# EAGLE schematic max7219-martix (EAGLE 6.4)
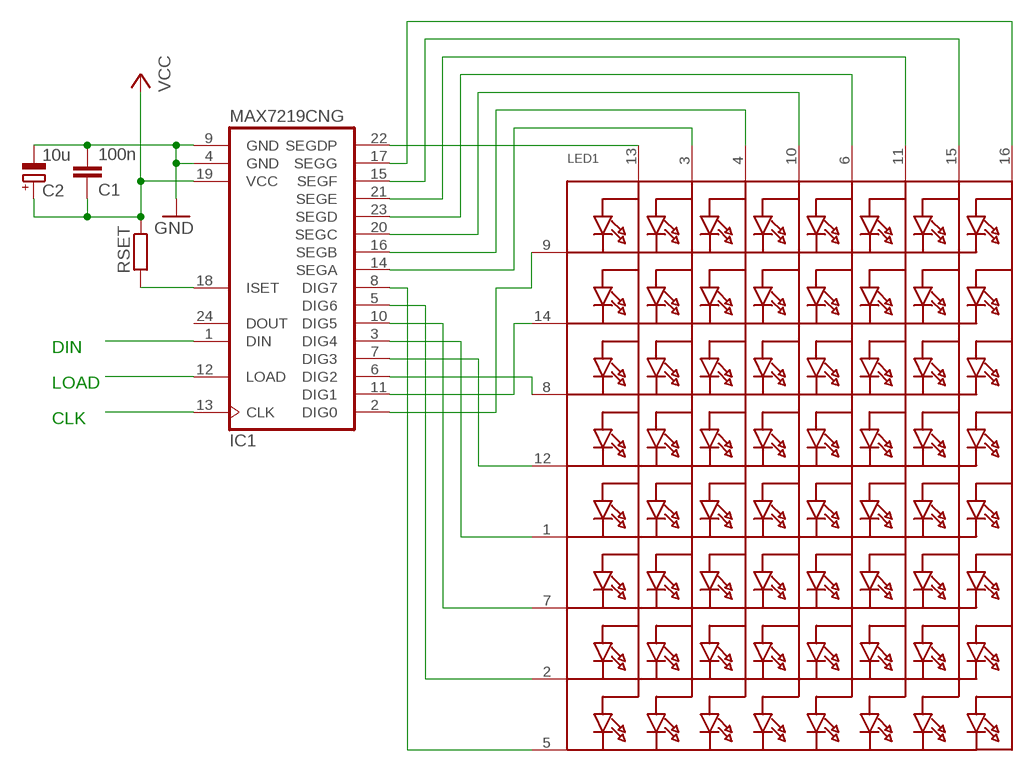
[diagram p0: schematic, sheet 1]

## Parts
C1  100n  C-EU025-024X044  [C025-024X044]
C2  10u  CPOL-EU139CLL-2R  [139CLL-2R]
IC1  MAX7219CNG  [DIL24-3]
LED1  SEGMENT_8X8_ROWCATHODEM12A881UR  [SEGMENT_BL-M12A881UR]
RSET  R-EU_0204/7  [0204/7]

## Nets
GND: C1.2 C2.- IC1.4(GND) IC1.9(GND)
N$1: IC1.14(SEGA) LED1.3(A2)
N$2: IC1.16(SEGB) LED1.4(A3)
N$3: IC1.20(SEGC) LED1.10(A4)
N$4: IC1.23(SEGD) LED1.6(A5)
N$5: IC1.21(SEGE) LED1.11(A6)
N$6: IC1.15(SEGF) LED1.15(A7)
N$7: IC1.17(SEGG) LED1.16(A8)
N$8: IC1.22(SEGDP) LED1.13(A1)
N$9: IC1.2(DIG0) LED1.9(K1)
N$10: IC1.11(DIG1) LED1.14(K2)
N$11: IC1.6(DIG2) LED1.8(K3)
N$12: IC1.7(DIG3) LED1.12(K4)
N$13: IC1.3(DIG4) LED1.1(K5)
N$14: IC1.10(DIG5) LED1.7(K6)
N$15: IC1.5(DIG6) LED1.2(K7)
N$16: IC1.8(DIG7) LED1.5(K8)
N$17: IC1.18(ISET) RSET.2
N$19: IC1.1(DIN)
N$20: IC1.12(LOAD)
N$21: IC1.13(CLK)
VCC: C1.1 C2.+ IC1.19(VCC) RSET.1
Unconnected: IC1.24(DOUT)

## Notes on the sheet
- DIN
- LOAD
- CLK

## Library data of the parts
C1 = resistor:C-EU: CAPACITOR, European symbol
C2 = resistor:CPOL-EU: POLARIZED CAPACITOR, European symbol
IC1 = maxim:MAX7219CNG: LED DISPLAY DRIVER; MF: MAXIM; MPN: MAX7219CNG; OC_FARNELL: 1523914; OC_NEWARK: 34C4018
LED1 = adafruit:SEGMENT_8X8_ROWCATHODE: 8x8 LED Segment Displays: Row = Cathode 0.7" Red 8X8 Matrix, 1.9mm Round LEDs - BL-M07C881UR 1.2" Red 8x8 Matrix, 3.0mm Round LEDs - BL-M12A881UR 1.2" Red 8x8 Matrix, 3.0mm Square LEDs - BL-M12A883
RSET = resistor:R-EU_: RESISTOR, European symbol